# Altium schematic sheet Sheet1.SchDoc
size A4
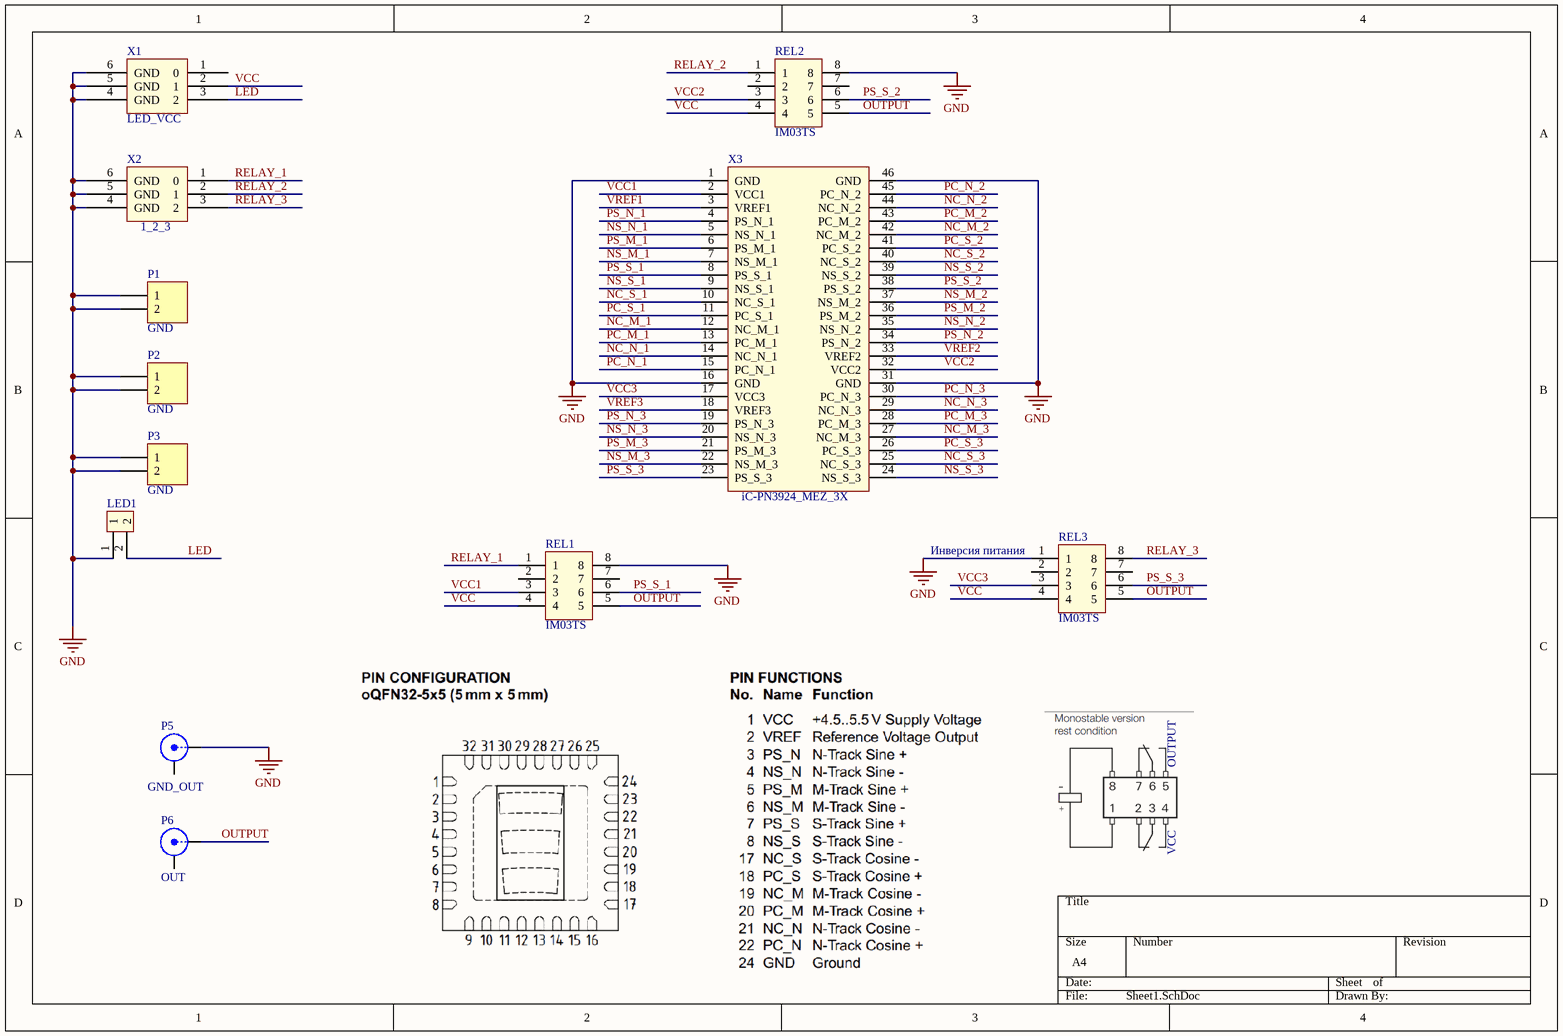
[diagram p0: Sheet1.SchDoc]

## Parts
LED1  KL_2  [KLEMMNIK_2]  (value not drawn)
P1  GND  [HDR1X2]
P2  GND  [HDR1X2]
P3  GND  [HDR1X2]
P5  GND_OUT  [BNC_RA CON]
P6  OUT  [BNC_RA CON]
REL1  IM03TS  [IM03TS]
REL2  IM03TS  [IM03TS]
REL3  IM03TS  [IM03TS]
X1  LED_VCC  [POWER]
X2  1_2_3  [POWER]
X3  iC-PN3924_MEZ_3X  [iC-PN3924_MEZ_3X]

## Nets
GND: LED1.1 P1.1 P1.2 P2.1 P2.2 P3.1 P3.2 P5.1(X) REL1.8 REL2.8 REL3.1 X1.4(GND) X1.5(GND) X1.6(GND) X2.4(GND) X2.5(GND) X2.6(GND) X3.1(GND) X3.16(GND) X3.31(GND) X3.46(GND)
LED: LED1.2 X1.3(2)
NC_M_1: X3.12(NC_M_1)
NC_M_2: X3.42(NC_M_2)
NC_M_3: X3.27(NC_M_3)
NC_N_1: X3.14(NC_N_1)
NC_N_2: X3.44(NC_N_2)
NC_N_3: X3.29(NC_N_3)
NC_S_1: X3.10(NC_S_1)
NC_S_2: X3.40(NC_S_2)
NC_S_3: X3.25(NC_S_3)
NS_M_1: X3.7(NS_M_1)
NS_M_2: X3.37(NS_M_2)
NS_M_3: X3.22(NS_M_3)
NS_N_1: X3.5(NS_N_1)
NS_N_2: X3.35(NS_N_2)
NS_N_3: X3.20(NS_N_3)
NS_S_1: X3.9(NS_S_1)
NS_S_2: X3.39(NS_S_2)
NS_S_3: X3.24(NS_S_3)
OUTPUT: P6.1(X) REL1.5 REL2.5 REL3.5
PC_M_1: X3.13(PC_M_1)
PC_M_2: X3.43(PC_M_2)
PC_M_3: X3.28(PC_M_3)
PC_N_1: X3.15(PC_N_1)
PC_N_2: X3.45(PC_N_2)
PC_N_3: X3.30(PC_N_3)
PC_S_1: X3.11(PC_S_1)
PC_S_2: X3.41(PC_S_2)
PC_S_3: X3.26(PC_S_3)
PS_M_1: X3.6(PS_M_1)
PS_M_2: X3.36(PS_M_2)
PS_M_3: X3.21(PS_M_3)
PS_N_1: X3.4(PS_N_1)
PS_N_2: X3.34(PS_N_2)
PS_N_3: X3.19(PS_N_3)
PS_S_1: REL1.6 X3.8(PS_S_1)
PS_S_2: REL2.6 X3.38(PS_S_2)
PS_S_3: REL3.6 X3.23(PS_S_3)
RELAY_1: REL1.1 X2.1(0)
RELAY_2: REL2.1 X2.2(1)
RELAY_3: REL3.8 X2.3(2)
VCC: REL1.4 REL2.4 REL3.4 X1.2(1)
VCC1: REL1.3 X3.2(VCC1)
VCC2: REL2.3 X3.32(VCC2)
VCC3: REL3.3 X3.17(VCC3)
VREF1: X3.3(VREF1)
VREF2: X3.33(VREF2)
VREF3: X3.18(VREF3)

Not connected (* = marked no-connect by the designer): P5 2(Y); P6 2(Y); REL1 2 7; REL2 2 7; REL3 2 7; X1 1(0)

## Notes on the sheet
- (near REL3) Инверсия питания
- OUTPUT
- VCC

## Library data of the parts
LED1 = KLEMMNIK_2
P1-P3 = Header 2: Header, 2-Pin; LatestRevisionDate: 17-Jul-2002; LatestRevisionNote: Re-released for DXP Platform.; Publisher: Altium Limited
P5 P6 = BNC: BNC Elbow Connector; LatestRevisionDate: 17-Jul-2002; LatestRevisionNote: Re-released for DXP Platform.; Publisher: Altium Limited
X1 X2 = POWER